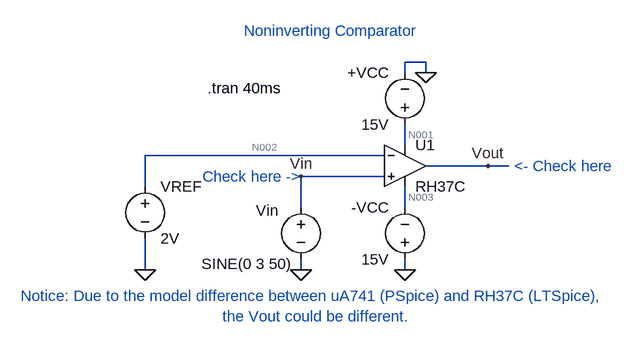
[diagram p0: schematic HLab02_noninverting_comparator.asc]
HLab02_noninverting_comparator.asc, the LTspice schematic file:
Version 4
SHEET 1 1068 680
WIRE 16 16 -16 16
WIRE -16 32 -16 16
WIRE 16 32 16 16
WIRE -16 144 -16 112
WIRE -48 160 -416 160
WIRE 112 176 16 176
WIRE 144 176 112 176
WIRE -48 192 -176 192
WIRE -416 208 -416 160
WIRE -176 240 -176 192
WIRE -16 240 -16 208
WIRE -416 336 -416 288
WIRE -176 336 -176 320
WIRE -16 336 -16 320
FLAG 16 32 0
FLAG -16 336 0
FLAG -416 336 0
FLAG -176 336 0
FLAG 112 176 Vout
FLAG -176 192 Vin
SYMBOL voltage -16 336 R180
WINDOW 0 24 96 Left 2
WINDOW 3 24 16 Left 2
SYMATTR InstName -VCC
SYMATTR Value 15V
SYMBOL voltage -16 128 R180
WINDOW 0 24 96 Left 2
WINDOW 3 24 16 Left 2
SYMATTR InstName +VCC
SYMATTR Value 15V
SYMBOL voltage -176 224 R0
WINDOW 0 -69 21 Left 2
WINDOW 3 -153 103 Left 2
SYMATTR InstName Vin
SYMATTR Value SINE(0 3 50)
SYMBOL voltage -416 192 R0
SYMATTR InstName VREF
SYMATTR Value 2V
SYMBOL Opamps/RH37C -16 112 R0
SYMATTR InstName U1
TEXT -320 56 Left 2 !.tran 40ms
TEXT -264 -32 Left 2 ;Noninverting Comparator
TEXT 152 176 Left 2 ;<- Check here
TEXT -328 192 Left 2 ;Check here ->
TEXT -152 392 Center 2 ;Notice: Due to the model difference between uA741 (PSpice) and RH37C (LTSpice), \nthe Vout could be different.

The netlist it stands for:
* HLab02_noninverting_comparator.asc
V§-VCC 0 N003 15V
V§+VCC N001 0 15V
Vin Vin 0 SINE(0 3 50)
VREF N002 0 2V
XU1 Vin N002 N001 N003 Vout RH37C  ; pins In+ In- V+ V- OUT
.tran 40ms
* Noninverting Comparator
* <- Check here
* Check here ->
* Notice: Due to the model difference between uA741 (PSpice) and RH37C (LTSpice),
* the Vout could be different.
.backanno
.end

* Results of the author's LTspice run, read from the files saved beside the schematic
* Operating Point, zero values left out:
*   V(n003) = -15 V
*   V(n001) = 15 V
*   V(n002) = 2 V
*   V(vout) = -13.77 V
*   I(Vref) = -1.25 mA
*   I(Vin) = 1.25 mA
*   I(+vcc) = -3 mA
*   I(-vcc) = -3 mA
*   Ix(u1:1) = -1.25 mA
*   Ix(u1:2) = 1.25 mA
*   Ix(u1:3) = 3 mA
*   Ix(u1:4) = -3 mA
*   Ix(u1:5) = 27.54 pA
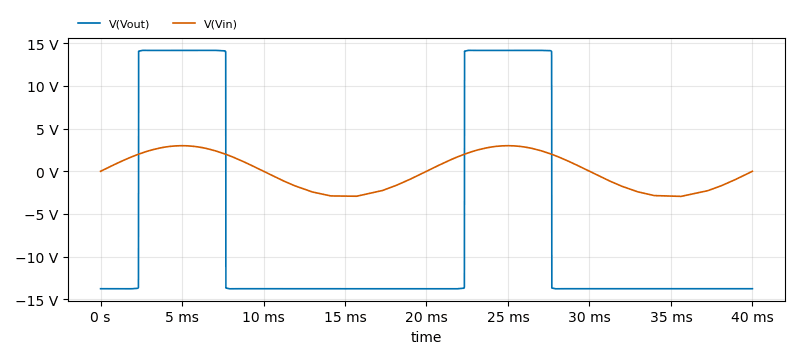
[diagram p1: Transient Analysis of HLab02_noninverting_comparator.asc, plotted from the saved traces]
* Transient Analysis, 1 run:
*   V(Vout): min -13.78 V, max 14.18 V, average -6.289 V, rms 13.87 V, last -13.77 V
*   V(Vin): min -2.942 V, max 3 V, average 12.52 mV, rms 2.111 V, last 0 V